# Altium schematic sheet Salida.SchDoc
size A4; SheetNumber: 4; SheetTotal: 4
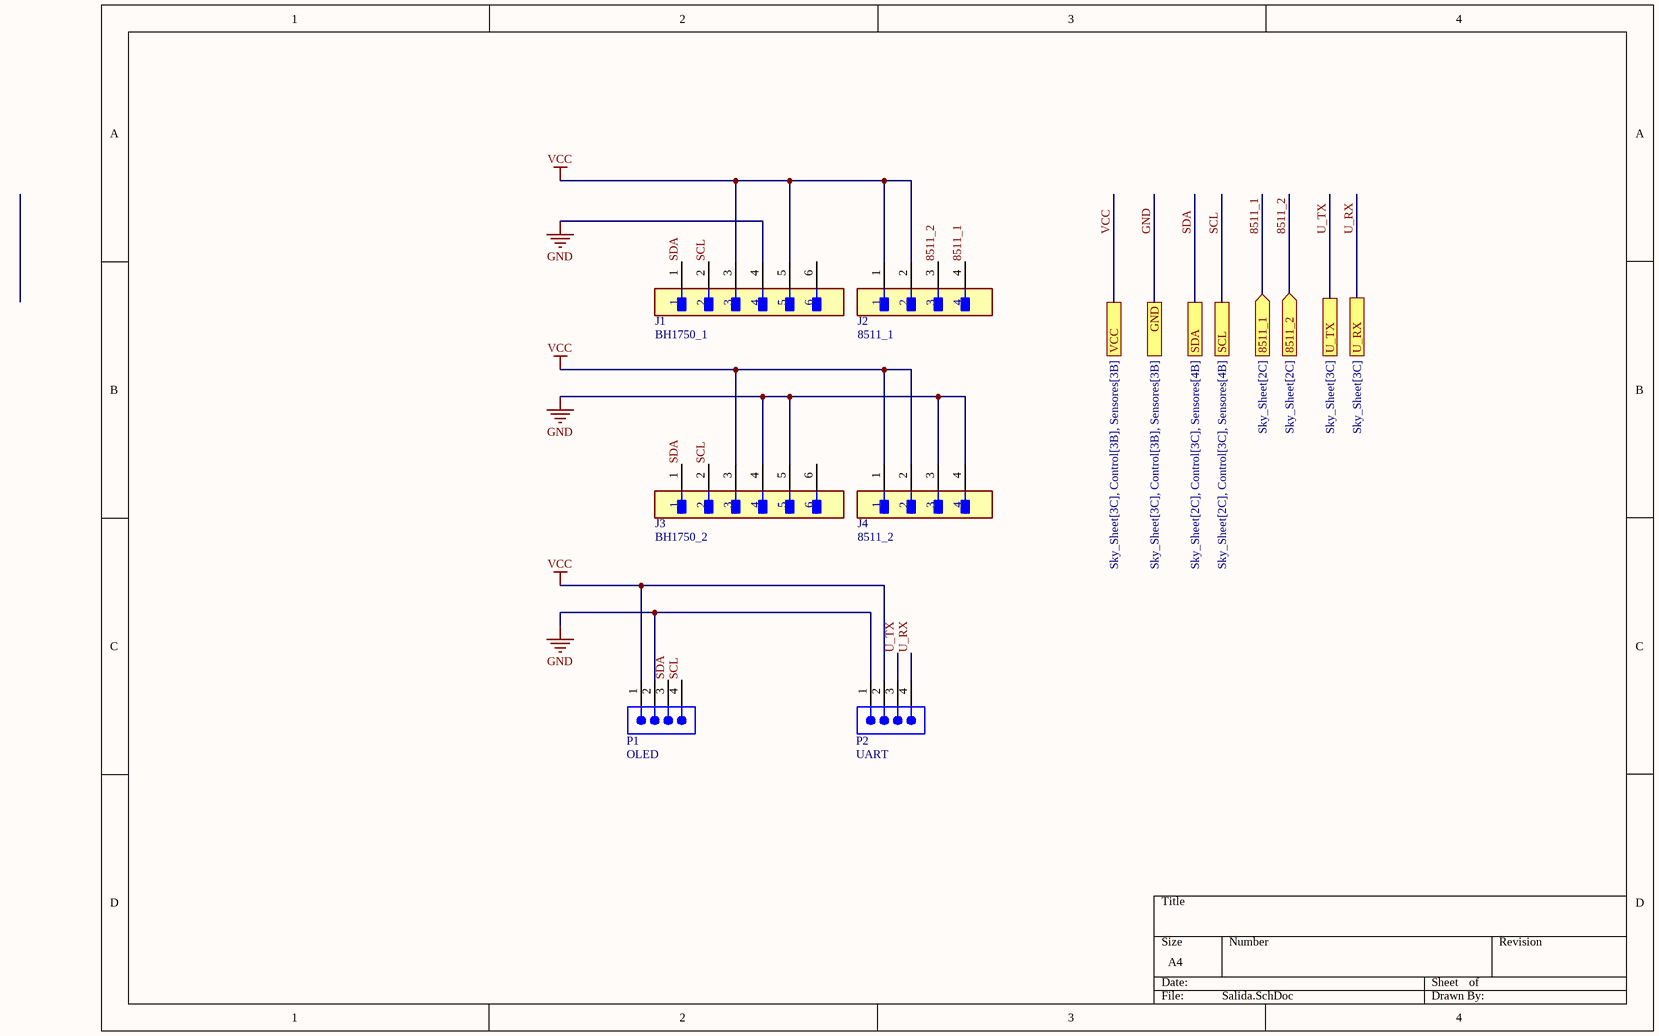
[diagram p0: Salida.SchDoc]

## Parts
J1  BH1750_1  [FP-B6B-XH-A_LF_SN-MFG]
J2  8511_1  [FP-B4B-XH-A_LF_SN-MFG]
J3  BH1750_2  [FP-B6B-XH-A_LF_SN-MFG]
J4  8511_2  [FP-B4B-XH-A_LF_SN-MFG]
P1  OLED  [SMTC-TSW-104-08-X-S]
P2  UART  [SMTC-TSW-104-08-X-S]

## Ports
8511_1 (in, see Sky_Sheet[2C]), 8511_2 (in, see Sky_Sheet[2C]), GND (see Sky_Sheet[3C], Control[3B], Sensores[3B]), SCL (see Sky_Sheet[2C], Control[3C], Sensores[4B]), SDA (see Sky_Sheet[2C], Control[3C], Sensores[4B]), U_RX (see Sky_Sheet[3C]), U_TX (see Sky_Sheet[3C]), VCC (see Sky_Sheet[3C], Control[3B], Sensores[3B])

## Nets
GND: J1.4 J3.4 J3.5 J4.3 J4.4 P1.2 P2.1 ; port GND
VCC: J1.3 J1.5 J2.1 J2.2 J3.3 J4.1 J4.2 P1.1 P2.2 ; port VCC
8511_1: J2.4 ; port 8511_1
8511_2: J2.3 ; port 8511_2
SCL: J1.2 J3.2 P1.4 ; port SCL
SDA: J1.1 J3.1 P1.3 ; port SDA
U_RX: P2.4 ; port U_RX
U_TX: P2.3 ; port U_TX

Not connected (* = marked no-connect by the designer): J1 6; J3 6

## Library data of the parts
J1 J3 = CMP-17439-000076-1: CONN HEADER VERT 6POS 2.5MM
J2 J4 = CMP-17439-000250-1: CONN HEADER VERT 4POS 2.5MM; Number of Contacts: 4; Contact Resistance: 20mR; Voltage Rating: 250V; Max Current Rating: 3A; Gender: Male; Wire/Cable Gauge: 22AWG; Mated Stacking Heights: 9.8mm; Insulation Resistance: 1GR; Orientation: Straight; Contact Type: Male Pin; Contact Finish - Mating: TIN; Series: XH; Max Voltage Rating (AC): 250V; Lead Pitch: 2.5mm; Contact Shape: Square; Insulation Color: Natural; Termination: Solder; Lead Free: Lead Free; Voltage Rating (AC): 250V; Number of Rows: 1; Flammability Rating: UL94 V-0; Number of Positions: 4; Max Operating Temperature: 85°C; Package Quantity: 500; Mount: Through Hole; REACH SVHC: No SVHC; Connector Type: Header; Insulation Material: Nylon; Fastening Type: Detent; Min Operating Temperature: -25°C; Housing Color: White; Packaging: Bulk; Contact Plating: Tin; Contact Material: Brass; Max Voltage Rating (DC): 250V; Housing Material: Polyamide; Color: Natural; Material: Polyamide; Pitch: 2.5mm; Depth: 5.75mm; Current Rating: 3A; Length: 12.4mm
P1 P2 = CMP-1024-00357-1: 0.025" SQ Post Header, Through-hole, Vertical, -55 to 125 degC, 2.54 mm Pitch, 4-Pin, Male, RoHS; Manufacturer: Samtec; PartNumber: TSW-104-08-G-S; Pitch: 2.54 mm; RoHS: True; ComponentLink3URL: http://www.samtec.com/documents/webfiles/cpdf/TSW-XXX-XX-XXX-X-XX-XXX-MKT.pdf; Mounting Technology: Through-hole; ComponentLink2URL: http://www.samtec.com/documents/webfiles/pdf/TSW_TH.PDF; ComponentLink1URL: http://www.samtec.com; ComponentLink3Description: Package Specification; PackageVersion: DM, 8/1988; ComponentLink2Description: Datasheet; PackageReference: TSW-104-08-X-S; PackageDescription: .025[0.64] SQ. Post Terminal Strip Assembly; ComponentLink1Description: Manufacturer URL; Temperature Range: -55 to 125 degC; DatasheetVersion: F-214; Orientation: Vertical